# EAGLE design SAMD51_Thing_Plus (EAGLE 7.6.0)
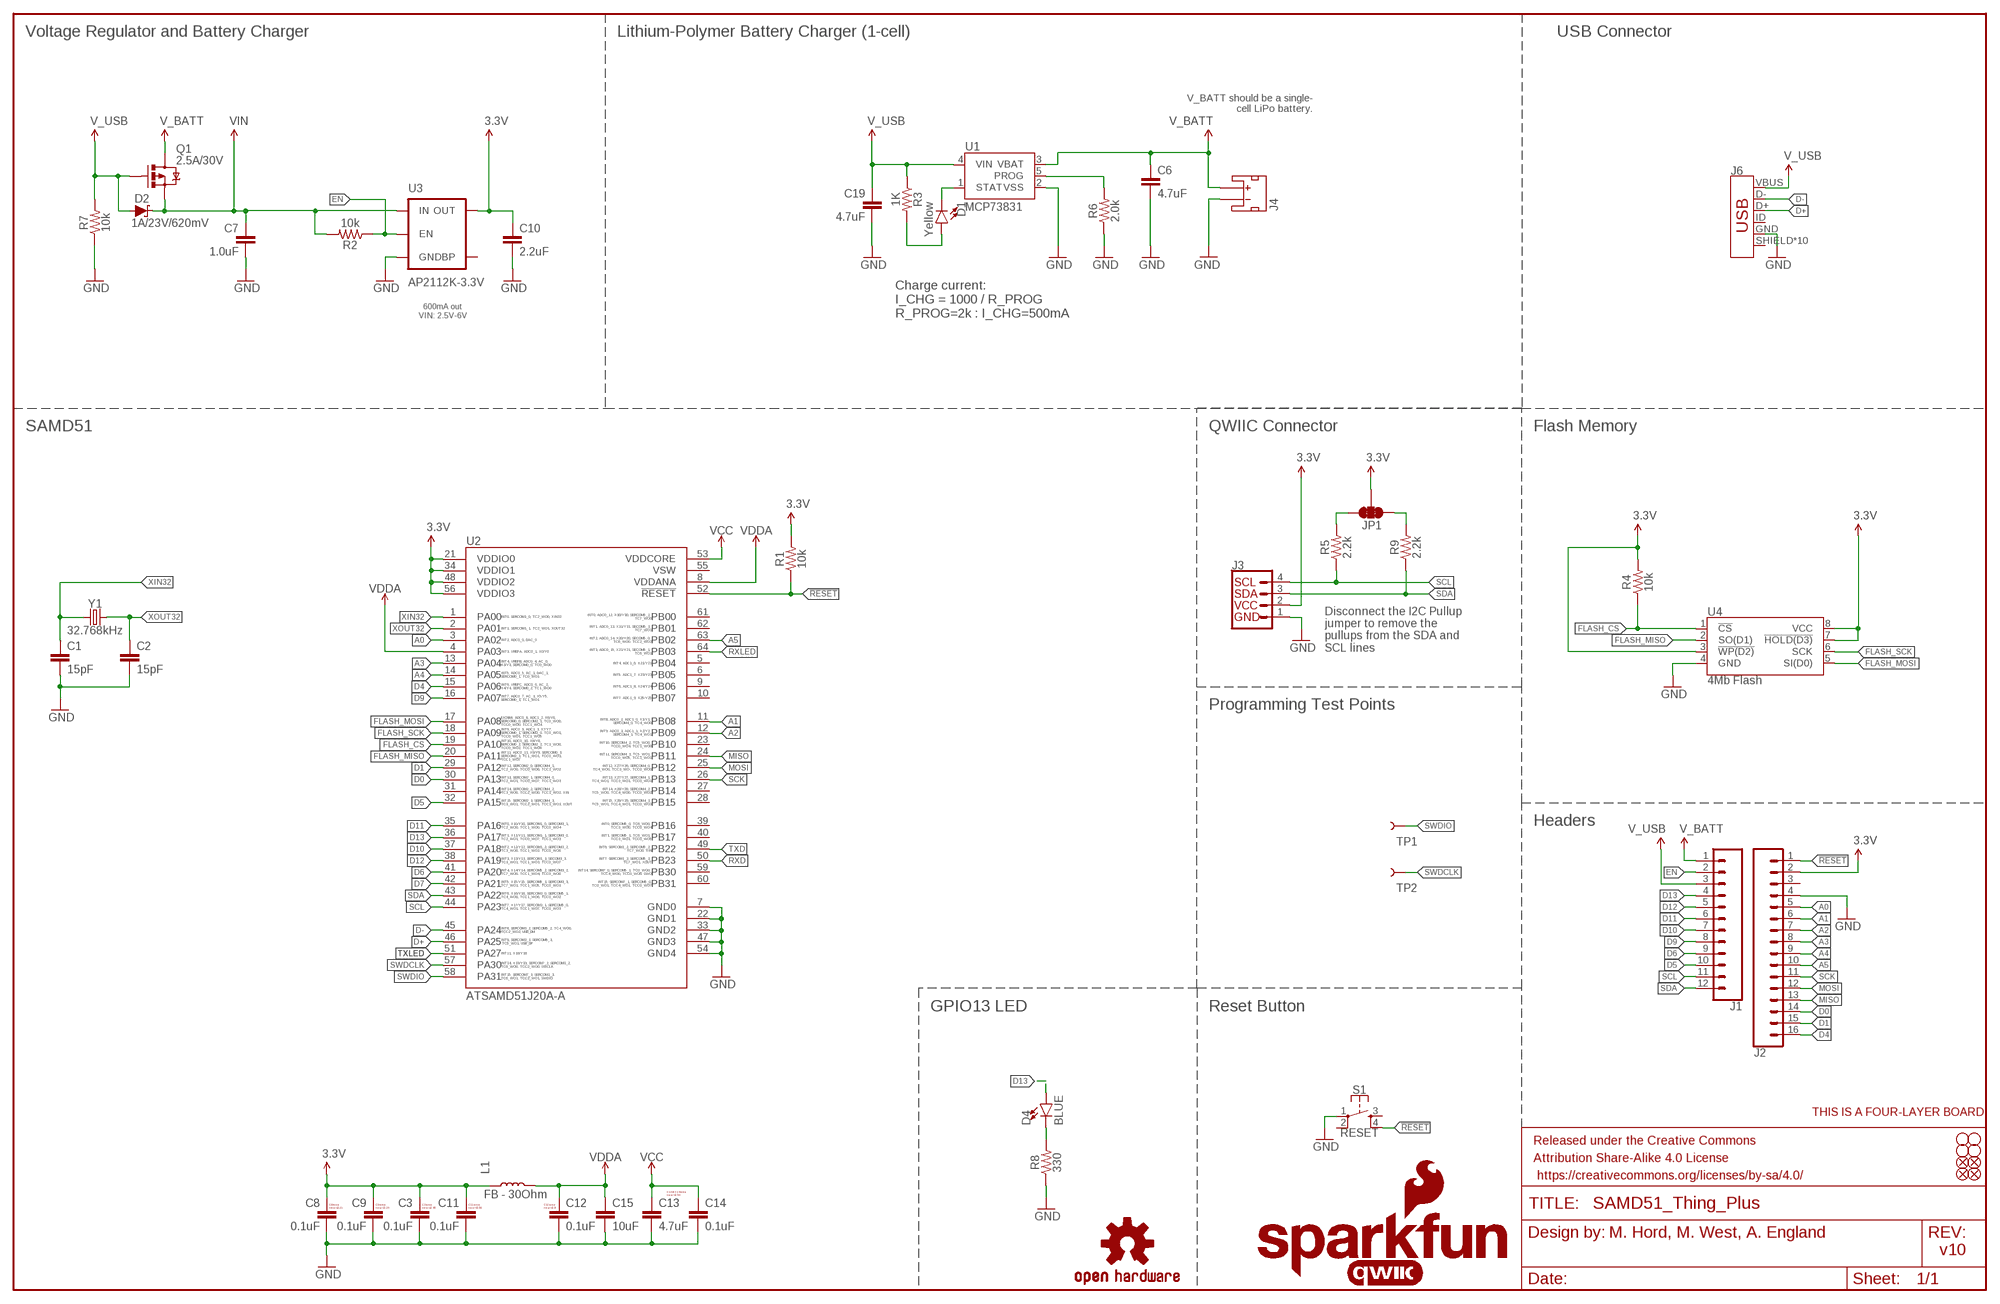
[diagram p0: schematic, sheet 1]

## Parts
C1  15pF  15PF-0402-50V-5%  [0402]
C2  15pF  15PF-0402-50V-5%  [0402]
C3  0.1uF  0.1UF-0402-16V-10%  [0402]
C6  4.7uF  4.7UF-0603-6.3V-(10%)  [0603]
C7  1.0uF  1.0UF-0603-16V-10%-X7R  [0603]
C8  0.1uF  0.1UF-0402-16V-10%  [0402]
C9  0.1uF  0.1UF-0402-16V-10%  [0402]
C10  2.2uF  2.2UF-0603-10V-20%  [0603]
C11  0.1uF  0.1UF-0402-16V-10%  [0402]
C12  0.1uF  0.1UF-0402-16V-10%  [0402]
C13  4.7uF  4.7UF-0603-6.3V-(10%)  [0603]
C14  0.1uF  0.1UF-0402-16V-10%  [0402]
C15  10uF  10UF-0805-10V-10%  [0805]
C19  4.7uF  4.7UF-0603-6.3V-(10%)  [0603]
D1  Yellow  LED-YELLOW0603  [LED-0603]
D2  1A/23V/620mV  DIODE-SCHOTTKY-BAT20J  [SOD-323]
D4  BLUE  LED-BLUE0603  [LED-0603]
FD1  FIDUCIALUFIDUCIAL  [FIDUCIAL-MICRO]
FD2  FIDUCIALUFIDUCIAL  [FIDUCIAL-MICRO]
FD3  FIDUCIALUFIDUCIAL  [FIDUCIAL-MICRO]
FD4  FIDUCIALUFIDUCIAL  [FIDUCIAL-MICRO]
FRAME1  FRAME-LEDGER  [CREATIVE_COMMONS]
H1  STAND-OFF  [STAND-OFF]
H2  STAND-OFF  [STAND-OFF]
H3  STAND-OFF  [STAND-OFF]
H4  STAND-OFF  [STAND-OFF]
J1  CONN_12SM_SQ_NO_SILK  [1X12_SM_SQ_NOSILK]
J2  CONN_161X16_SM_SQ_NOSILK  [1X16_SM_SQ_NOSILK]
J3  QWIIC_CONNECTORJS-1MM  [JST04_1MM_RA]
J4  JST_2MM_MALE  [JST-2-SMD]
J6  AMP FCI 10103594-0001LF  USB_MICRO-B_HALF_PTH_MILL  [USB-MICROB-PTH-MILL]
JP1  JUMPER-SMT_3_2-NC_TRACE_SILK  [SMT-JUMPER_3_2-NC_TRACE_SILK]
L1  FB - 30Ohm  INDUCTORFB-30OHM  [0603]
LOGO1  FOUR_LAYER_WARNING  [FOUR_LAYER_WARNING]
LOGO2  OSHW-LOGOMINI  [OSHW-LOGO-MINI]
LOGO3  SFE_LOGO_NAME_FLAME.1_INCH  [SFE_LOGO_NAME_FLAME_.1]
LOGO4  SFE_LOGO_FLAME.1_INCH  [SFE_LOGO_FLAME_.1]
Q1  2.5A/30V  MOSFET-PCHANNELDMG2307L  [SOT23-3@1]
R1  10k  10KOHM-0603-1/10W-1%  [0603]
R2  10k  10KOHM-0603-1/10W-1%  [0603]
R3  1K  1KOHM-1/10W-1%(0603)  [0603]
R4  10k  10KOHM-0603-1/10W-1%  [0603]
R5  2.2k  2.2KOHM-0603-1/10W-1%  [0603]
R6  2.0k  2.0KOHM1/10W5%(0603)  [0603]
R7  10k  10KOHM-0603-1/10W-1%  [0603]
R8  330  330OHM1/10W1%(0603)  [0603]
R9  2.2k  2.2KOHM-0603-1/10W-1%  [0603]
S1  RESET  MOMENTARY-SWITCH-SPST-2-SMD-4.6X2.8MM  [TACTILE_SWITCH_SMD_4.6X2.8MM]
TP1  TEST-POINTTP_15TH_THRU  [TP_15TH]
TP2  TEST-POINTTP_15TH_THRU  [TP_15TH]
U1  MCP73831  [SOT23-5]
U2  ATSAMD51J20A-A  [TQFP64]
U3  AP2112K-3.3V  V_REG_LDOSMD  [SOT23-5]
U4  4Mb Flash  AT25SF041  [SO08]
U$69  QWIIC_LOGO_5MM  [QWIIC_5MM]
Y1  32.768kHz  CRYSTAL-32.768KHZSMD-3.2X1.5  [CRYSTAL-SMD-3.2X1.5MM]

## Nets
3.3V: C3.1 C8.1 C9.1 C10.1 C11.1 J2.2 J3.2 JP1.2 L1.1 R1.2 R4.2 U2.21(VDDIO0) U2.34(VDDIO1) U2.48(VDDIO2) U2.56(VDDIO3) U3.5(OUT) U4.3(!WP(D2)) U4.7(!HOLD(D3)) U4.8(VCC)
!RESET: J2.1 R1.1 S1.4 U2.52(!RESET)
A0: J2.5 U2.3(PA02)
A1: J2.6 U2.11(PB08)
A2: J2.7 U2.12(PB09)
A3: J2.8 U2.13(PA04)
A4: J2.9 U2.14(PA05)
A5: J2.10 U2.63(PB02)
D0: J2.14 U2.30(PA13)
D1: J2.15 U2.29(PA12)
D4: J2.16 U2.15(PA06)
D5: J1.10 U2.32(PA15)
D6: J1.9 U2.41(PA20)
D7: U2.42(PA21)
D9: J1.8 U2.16(PA07)
D10: J1.7 U2.37(PA18)
D11: J1.6 U2.35(PA16)
D12: J1.5 U2.38(PA19)
D13: D4.A J1.4 U2.36(PA17)
D+: J6.D+ U2.46(PA25)
D-: J6.D- U2.45(PA24)
EN: J1.2 R2.1 U3.3(EN)
FLASH_CS: R4.1 U2.19(PA10) U4.1(!CS)
FLASH_MISO: U2.20(PA11) U4.2(SO(D1))
FLASH_MOSI: U2.17(PA08) U4.5(SI(D0))
FLASH_SCK: U2.18(PA09) U4.6(SCK)
GND: C1.2 C2.2 C3.2 C6.2 C7.2 C8.2 C9.2 C10.2 C11.2 C12.2 C13.2 C14.2 C15.2 C19.2 J2.4 J3.1 J4.1(-) J6.GND R6.1 R7.1 R8.1 S1.1 U1.2(VSS) U2.7(GND0) U2.22(GND1) U2.33(GND2) U2.47(GND3) U2.54(GND4) U3.2(GND) U4.4(GND)
MISO: J2.13 U2.24(PB11)
MOSI: J2.12 U2.25(PB12)
N$1: D4.C R8.2
N$2: JP1.3 R5.2
N$3: JP1.1 R9.2
N$9: D1.C U1.1(STAT)
N$14: R6.2 U1.5(PROG)
N$17: D1.A R3.2
RXD: U2.50(PB23)
RXLED: U2.64(PB03)
SCK: J2.11 U2.26(PB13)
SCL: J1.11 J3.4 R5.1 U2.44(PA23)
SDA: J1.12 J3.3 R9.1 U2.43(PA22)
SWDCLK: TP2.P$1 U2.57(PA30)
SWDIO: TP1.P$1 U2.58(PA31)
TXD: U2.49(PB22)
TXLED: U2.51(PA27)
V_BATT: C6.1 J1.1 J4.2(+) Q1.3(D) U1.3(VBAT)
V_USB: C19.1 D2.A J1.3 J6.VBUS Q1.1(G) R3.1 R7.2 U1.4(VIN)
VCC: C13.1 C14.1 U2.53(VDDCORE)
VDDA: C12.1 C15.1 L1.2 U2.4(PA03) U2.8(VDDANA)
VIN: C7.1 D2.C Q1.2(S) R2.2 U3.1(IN)
XIN32: C1.1 U2.1(PA00) Y1.P$1
XOUT32: C2.1 U2.2(PA01) Y1.P$2
Unconnected: J2.3 J4.NC1(PAD1) J4.NC2(PAD2) J6.ID J6.SHIELD J6.SHIELD2(SHIELD) J6.SHIELD3(SHIELD) J6.SHIELD4(SHIELD) J6.SHIELD5(SHIELD) J6.SHIELD6(SHIELD) J6.SHIELD7(SHIELD) J6.SHIELD8(SHIELD) J6.SHIELD9(SHIELD) J6.SHIELD10(SHIELD) S1.2 S1.3 U2.5(PB04) U2.6(PB05) U2.9(PB06) U2.10(PB07) U2.23(PB10) U2.27(PB14) U2.28(PB15) U2.31(PA14) U2.39(PB16) U2.40(PB17) U2.55(VSW) U2.59(PB30) U2.60(PB31) U2.61(PB00) U2.62(PB01) U3.4(BP)

## Notes on the sheet
- Voltage Regulator and Battery Charger | Lithium-Polymer Battery Charger (1-cell)
- USB Connector
- V_BATT should be a single-
  cell LiPo battery.
- Charge current:
  I_CHG = 1000 / R_PROG
  R_PROG=2k : I_CHG=500mA
- 600mA out
  VIN: 2.5V-6V
- SAMD51 | QWIIC Connector | Flash Memory
- Disconnect the I2C Pullup 
  jumper to remove the 
  pullups from the SDA and 
  SCL lines
- Programming Test Points
- Headers
- GPIO13 LED | Reset Button
- C13 & C14 to be
  near U2.53
- C8 to be
  near U2.21
- C9 to be
  near U2.34
- C3 to be
  near U2.48
- C11 to be
  near U2.56
- C12 to be
  near U2.8
- M. Hord, M. West, A. England
- v10

## Library data of the parts
C1 C2 = SparkFun-Capacitors:15PF: 15pF ceramic capacitors A capacitor is a passive two-terminal electrical component used to store electrical energy temporarily in an electric field.; PROD_ID: CAP-13063
C3 C8 C9 C11 C12 C14 = SparkFun-Capacitors:0.1UF: 0.1µF ceramic capacitors A capacitor is a passive two-terminal electrical component used to store electrical energy temporarily in an electric field.; PROD_ID: CAP-12416
C6 C13 C19 = SparkFun-Capacitors:4.7UF: 4.7µF ceramic capacitors A capacitor is a passive two-terminal electrical component used to store electrical energy temporarily in an electric field.; PROD_ID: CAP-08280
C7 = SparkFun-Capacitors:1.0UF: 1µF ceramic capacitors A capacitor is a passive two-terminal electrical component used to store electrical energy temporarily in an electric field.; PROD_ID: CAP-13930
C10 = SparkFun-Capacitors:2.2UF: 2.2µF ceramic capacitors A capacitor is a passive two-terminal electrical component used to store electrical energy temporarily in an electric field.; PROD_ID: CAP-07888
C15 = SparkFun-Capacitors:10UF: 10.0µF ceramic capacitors A capacitor is a passive two-terminal electrical component used to store electrical energy temporarily in an electric field.; PROD_ID: CAP-11330
D1 = SparkFun-LED:LED-YELLOW: Yellow SMD LED Used in manufacturing several products at SparkFun. Packages: 0603 - SMD 0603 package[Product Link] <http://www.kingbrightusa.com/product.asp?catalog_name=LED&product_id=APT1608SYCK> 0603 -SMART - SMART SMD 0603 package (more efficient/more expensive) [Product Link] <http://www.osram-os.com/osram_os/en/products/product-catalog/led-light-emitting-diodes/smartled-0603/ly-l29k/index.jsp> LilyPad - SMD1206 package[Product Datasheet] <https://www.sparkfun.com/datasheets/DevTools/LilyPad/Q150YUS4.pdf> SparkFun Products: Blynk Board <https://www.sparkfun.com/products/13794> IOIO-OTG <https://www.sparkfun.com/products/13613> XBee Explorer Serial <https://www.sparkfun.com/products/13225>; PROD_ID: DIO-09003
D2 = SparkFun-DiscreteSemi:DIODE-SCHOTTKY: Schottky diode A Schottky diode is a semiconductor diode which has a low forward voltage drop and a very fast switching action.; PROD_ID: DIO-11623
D4 = SparkFun-LED:LED-BLUE: Blue SMD LED Used in manufacturing of various products at SparkFun Packages: 0603 - SMD 0603 package [Product Link] <http://www.digikey.com/product-detail/en/SMLE12BC7TT86/511-1589-2-ND/1641808> 1206 - SMD1206 package [Product Link] <http://www.digikey.com/product-detail/en/lite-on-inc/LTST-C150TBKT/160-1643-1-ND/573584> SparkFun Products: ESP8266 Thing-Dev Board <https://www.sparkfun.com/products/13711> RedBoard <https://www.sparkfun.com/products/12757>; PROD_ID: DIO-08575
FD1-FD4 = SparkFun-Aesthetics:FIDUCIAL: Fiducial Alignment Points Point-of-reference for pick-and-place machines and other optical instruments.
FRAME1 = SparkFun-Aesthetics:FRAME-LEDGER: Schematic Frame - Ledger Standard 11x14 US Ledger frame
H1-H4 = SparkFun-Hardware:STAND-OFF: Stand Off Drill holes for mechanically mounting via screws, standoffs, etc. Note: Use the keepout ring to avoid running the screw head into surrounding components. Variant Overviews STAND-OFF - Mechanical footprint for a #4 phillips button head screw. STAND-OFF-TIGHT - Mechanical footprint for a #4 phillips button head screw, Example SparkFun Products Screw - Phillips Head (1/4", 4-40, 10 pack) <https://www.sparkfun.com/products/10453> (PRT-10453) Screw - Phillips Head (1/2", 4-40, 10 pack) <https://www.sparkfun.com/products/10452> (PRT-10452) Screw - Phillips Head (3/4", 4-40, 10 pack) <https://www.sparkfun.com/products/10451> (PRT-10451) Screw - Phillips Head (1", 4-40, 10 pack) <https://www.sparkfun.com/products/10450> (PRT-10450)
J1 = SparkFun-Connectors:CONN_12: Multi connection point. Often used as Generic Header-pin footprint for 0.1 inch spaced/style header connections On any of the 0.1 inch spaced packages, you can populate with these: Break Away Headers - Straight <https://www.sparkfun.com/products/116> (PRT-00116) Break Away Male Headers - Right Angle <https://www.sparkfun.com/products/553> (PRT-00553) Female Headers <https://www.sparkfun.com/products/115> (PRT-00115) Break Away Headers - Machine Pin <https://www.sparkfun.com/products/117> (PRT-00117) Break Away Female Headers - Swiss Machine Pin <https://www.sparkfun.com/products/743> (PRT-00743) For SCREWTERMINALS and SPRING TERMINALS visit here: Screw Terimnals on SparkFun.com <https://www.sparkfun.com/search/results?term=Screw+Terminals> (5mm/3.5mm/2.54mm spacing) This device is also useful as a general connection point to wire up your design to another part of your project. Our various solder wires solder well into these plated through hole pads. Hook-Up Wire - Assortment (Stranded, 22 AWG) <https://www.sparkfun.com/products/11375> (PRT-11375) Hook-Up Wire - Assortment (Solid Core, 22 AWG) <https://www.sparkfun.com/products/11367> (PRT-11367) View the entire wire category on our website here <https://www.sparkfun.com/categories/141> Special notes: Molex polarized connector foot print use with SKU : PRT-08231 with associated crimp pins and housings. 1MM SMD Version SKU: PRT-10208 NOTES ON THE VARIANTS LOCK and LOCK_LONGPADS... This footprint was designed to help hold the alignment of a through-hole component (i.e. 6-pin header) while soldering it into place. You may notice that each hole has been shifted either up or down by 0.005 of an inch from it's more standard position (which is a perfectly straight line). This slight alteration caused the pins (the squares in the middle) to touch the edges of the holes. Because they are alternating, it causes a "brace" to hold the component in place. 0.005 has proven to be the perfect amount of "off-center" position when using our standard breakaway headers. Although looks a little odd when you look at the bare footprint, once you have a header in there, the alteration is very hard to notice. Also,if you push a header all the way into place, it is covered up entirely on the bottom side.
J2 = SparkFun-Connectors:CONN_16: Multi connection point. Often used as Generic Header-pin footprint for 0.1 inch spaced/style header connections On any of the 0.1 inch spaced packages, you can populate with these: Break Away Headers - Straight <https://www.sparkfun.com/products/116> (PRT-00116) Break Away Male Headers - Right Angle <https://www.sparkfun.com/products/553> (PRT-00553) Female Headers <https://www.sparkfun.com/products/115> (PRT-00115) Break Away Headers - Machine Pin <https://www.sparkfun.com/products/117> (PRT-00117) Break Away Female Headers - Swiss Machine Pin <https://www.sparkfun.com/products/743> (PRT-00743) For SCREWTERMINALS and SPRING TERMINALS visit here: Screw Terimnals on SparkFun.com <https://www.sparkfun.com/search/results?term=Screw+Terminals> (5mm/3.5mm/2.54mm spacing) This device is also useful as a general connection point to wire up your design to another part of your project. Our various solder wires solder well into these plated through hole pads. Hook-Up Wire - Assortment (Stranded, 22 AWG) <https://www.sparkfun.com/products/11375> (PRT-11375) Hook-Up Wire - Assortment (Solid Core, 22 AWG) <https://www.sparkfun.com/products/11367> (PRT-11367) View the entire wire category on our website here <https://www.sparkfun.com/categories/141> Special notes: Molex polarized connector foot print use with SKU : PRT-08231 with associated crimp pins and housings. 1MM SMD Version SKU: PRT-10208 NOTES ON THE VARIANTS LOCK and LOCK_LONGPADS... This footprint was designed to help hold the alignment of a through-hole component (i.e. 6-pin header) while soldering it into place. You may notice that each hole has been shifted either up or down by 0.005 of an inch from it's more standard position (which is a perfectly straight line). This slight alteration caused the pins (the squares in the middle) to touch the edges of the holes. Because they are alternating, it causes a "brace" to hold the component in place. 0.005 has proven to be the perfect amount of "off-center" position when using our standard breakaway headers. Although looks a little odd when you look at the bare footprint, once you have a header in there, the alteration is very hard to notice. Also,if you push a header all the way into place, it is covered up entirely on the bottom side.
J3 = SparkFun-Connectors:QWIIC_CONNECTOR: SparkFun I2C Standard Qwiic Connector An SMD 1mm pitch JST connector makes it easy and quick (get it? Qwiic?) to connect I2C devices to each other. The Qwiic system <http://www.sparkfun.com/qwiic> enables fast and solderless connection between popular platforms and various sensors and actuators. We carry 200mm <https://www.sparkfun.com/products/14204>, 100mm <https://www.sparkfun.com/products/14205>, 50mm <https://www.sparkfun.com/products/14206>, and breadboard friendly <https://www.sparkfun.com/products/14207> Qwiic cables. We also offer 10 pcs strips <https://www.sparkfun.com/products/14323> the SMD connectors.; PROD_ID: CONN-13694
J4 = SparkFun-Connectors:JST_2MM_MALE: JST 2MM MALE RA CONNECTOR Two pin, compact surface mount connector. Commonly used as a battery input connection point. We really like the solid locking feeling and high current rating on these small connectors. We use these all the time as battery connectors. Mates to single-cell LiPo batteries. Here is the connector we sell at SparkFun: JST Right Angle Connector - White <https://www.sparkfun.com/products/8612> (PRT-08612) Datasheet <http://www.sparkfun.com/datasheets/Prototyping/Connectors/JST-Horizontal.pdf> It was used on these SparkFun products: SparkFun MOSFET Power Controller <https://www.sparkfun.com/products/11214> (PRT-11214) SparkFun Battery Babysitter - LiPo Battery Manager <https://www.sparkfun.com/products/13777> (PRT-13777) And many, many others that required a lipo battery connection.; PROD_ID: CONN-11443; SF_ID: PRT-08612
J6 = SparkFun-Connectors:USB_MICRO-B: USB Type Micro-B Connector Male/female and PTH/SMT variants SparkFun Products: SparkFun microB USB Breakout <https://www.sparkfun.com/products/12035> SparkFun USB microB Plug Breakout <https://www.sparkfun.com/products/10031> SparkFun ESP8266 Thing <https://www.sparkfun.com/products/13231>; PROD_ID: CONN-13711
JP1 = SparkFun-Jumpers:JUMPER-SMT_3_2-NC_TRACE: Normally closed trace jumper (2 of 2 connections) This jumper has a trace between all three pads so they are normally closed (NC). Use a razor knife to open the connection(s). For best results follow the IPC guidelines for cutting traces: Cutout at least 0.063 mm (0.005 in). Remove all loose material to clean up the cut area. Seal the cut with an approved epoxy. Reapply solder to reclose the connection(s).
L1 = SparkFun-Coils:INDUCTOR: Inductors Resist changes in electrical current. Basically a coil of wire. SparkFun Products: SparkFun Load Cell Amplifier - HX711 <https://www.sparkfun.com/products/13879> IOIO-OTG - V2.2 <https://www.sparkfun.com/products/13613>; PROD_ID: NDUC-07859
LOGO1 = SparkFun-Aesthetics:FOUR_LAYER_WARNING: Four-Layer Board Warning - tDoc Layer Warning text which will appear on both the schematic and the board file, notifying viewers that the design is a four-layer PCB.
LOGO2 = SparkFun-Aesthetics:OSHW-LOGO: Open-Source Hardware (OSHW) Logo This logo indicates the piece of hardware it is found on incorporates a OSHW license and/or adheres to the definition of open source hardware found here: http://freedomdefined.org/OSHW
LOGO3 = SparkFun-Aesthetics:SFE_LOGO_NAME_FLAME: SparkFun Font Logo w/ Flame This is the SparkFun full logo. The logo on the schematic will always be the same size; the package variant is the height of the flame part of the logo. Default layer for the logo on the board is tSilk.
LOGO4 = SparkFun-Aesthetics:SFE_LOGO_FLAME: SparkFun Flame Logo This is the SparkFun flame logo. The logo on the schematic will always be the same size; the package variant is the height of the flame. Default layer for the logo on the board is tSilk.
Q1 = SparkFun-DiscreteSemi:MOSFET-PCHANNEL: Generic PMOSFET IRLML2244 - TRANS-11153 (SOT-23 -20V -4.3A) (1.Gate 2.Source 3.Drain) FQP27P06 - COM-10349 <http://www.sparkfun.com/products/10349> (TO-220 -60V -27A) (1.Gate 2.Source 3.Drain); PROD_ID: TRANS-11308
R1 R2 R4 R7 = SparkFun-Resistors:10KOHM: 10kΩ resistor A resistor is a passive two-terminal electrical component that implements electrical resistance as a circuit element. Resistors act to reduce current flow, and, at the same time, act to lower voltage levels within circuits. - Wikipedia; PROD_ID: RES-00824
R3 = SparkFun-Resistors:1KOHM-1/10W-1%(0603): RES-07856; PROD_ID: RES-07856
R5 R9 = SparkFun-Resistors:2.2KOHM: 2.2kΩ resistor A resistor is a passive two-terminal electrical component that implements electrical resistance as a circuit element. Resistors act to reduce current flow, and, at the same time, act to lower voltage levels within circuits. - Wikipedia; PROD_ID: RES-08272
R6 = SparkFun-Resistors:2.0KOHM1/10W5%(0603): RES-08296; PROD_ID: RES-08296
R8 = SparkFun-Resistors:330OHM1/10W1%(0603): RES-00818; PROD_ID: RES-00818
S1 = SparkFun-Switches:MOMENTARY-SWITCH-SPST-2: Momentary Switch (Pushbutton) - SPST - Two Circuits Normally-open (NO) SPST momentary switches (buttons, pushbuttons). Schematic symbol includes two switch circuits. Variants SMD-4.6MMX2.8MM - 4.60mm x 2.80mm Tactile Momentary Button Switch - Used on SparkFun SAMD21 Mini Breakout <https://www.sparkfun.com/products/13664> SMD-5.2MM - Mini Pushbutton Switch - SMD <https://www.sparkfun.com/products/8720> - Used on Arduino Pro Mini <https://www.sparkfun.com/products/11114>; PROD_ID: SWCH-13065
TP1 TP2 = SparkFun-Connectors:TEST-POINT: SparkFun Test Points Bare copper test points for troubleshooting or In-Circuit-Testing. These are used by our Production team for verifying production board runs using pogo-pins on test beds. SparkFun Products: SparkFun LSM9DS1 Breakout <https://www.sparkfun.com/products/13284> SparkFun PSOC <https://www.sparkfun.com/products/13714> SparkFun Load Cell Amplifier <https://www.sparkfun.com/products/13879>
U1 = SparkFun-PowerIC:MCP73831: Miniature single cell, fully integrated Li-Ion, Li-polymer charge management controller http://ww1.microchip.com/downloads/en/DeviceDoc/20001984g.pdf IC-09995; PROD_ID: IC-09995
U2 = SparkFun-IC-Microcontroller:ATSAMD51J20A-A; PROD_ID: IC-13952
U3 = SparkFun-PowerIC:V_REG_LDO: Voltage Regulator LDO Standard 150mA LDO voltage regulator in SOT-23 layout. Micrel part MIC5205. BP (by-pass) pin is used to lower output noise with 470pF cap.; PROD_ID: VREG-12457
U4 = SparkFun-IC-Memory:AT25SF041: AT25SF041 4Mb Serial Flash Memory 104MHz, SPI, 8-SOIC Datasheet <http://www.adestotech.com/wp-content/uploads/DS-AT25SF041_044.pdf> SparkFun Products: SparkFun ESP8266 Thing <https://www.sparkfun.com/products/13231> SparkFun ESP8266 Thing - Dev Board <https://www.sparkfun.com/products/13711>; PROD_ID: IC-12455; VALUE: 4MB Flash
U$69 = SparkFun-Aesthetics:QWIIC_LOGO: Qwiic Logos for placement on schematic and PCB. The 5.5mm silk logo is best for placing next to Qwiic connector.
Y1 = SparkFun-Clocks:CRYSTAL-32.768KHZ: 32.768kHz Crystal Frequency: 32.768kHz Frequency Stability: ±20ppm Load Capacitance: 12.5pF (PTH-2X6 & SMD-3.2X1.5), 6pF (SMD-2X6) SparkFun Products: SparkFun BigTime Watch Kit <https://www.sparkfun.com/products/11734> SparkFun nRF52832 Breakout <https://www.sparkfun.com/products/13990> SparkFun Real Time Clock Module <https://www.sparkfun.com/products/12708>; PROD_ID: XTAL-13062

## Board
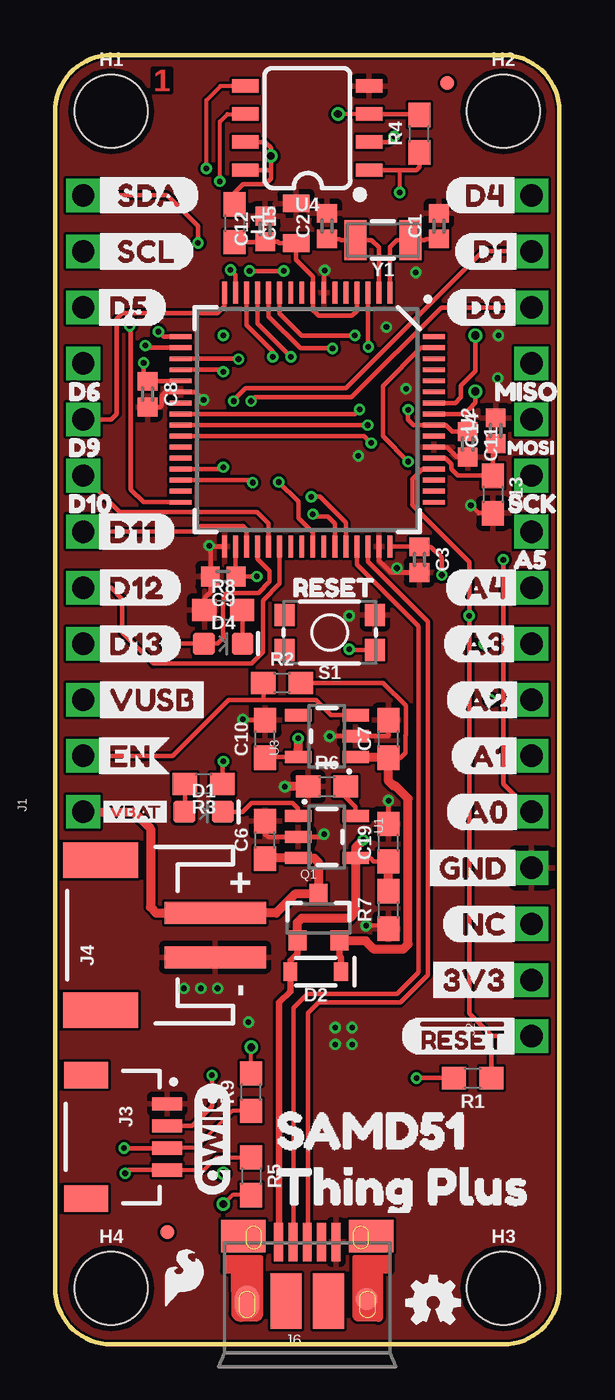
[diagram p1: board, top side]
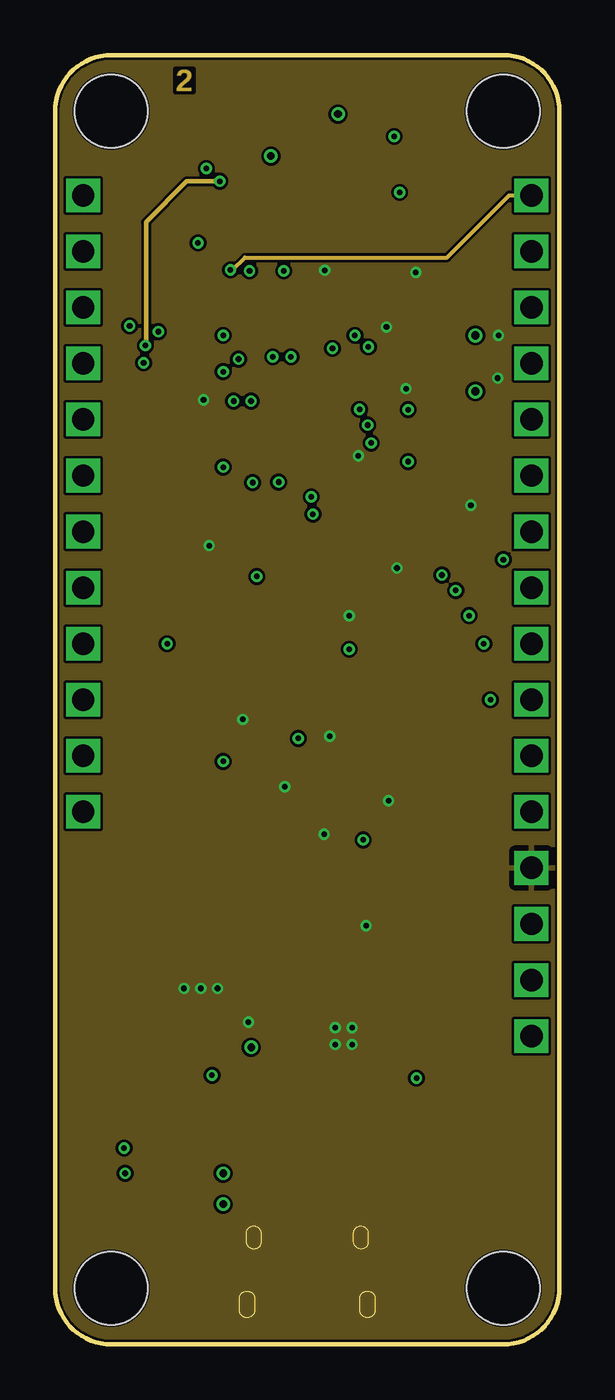
[diagram p2: board, inner layer Route2]
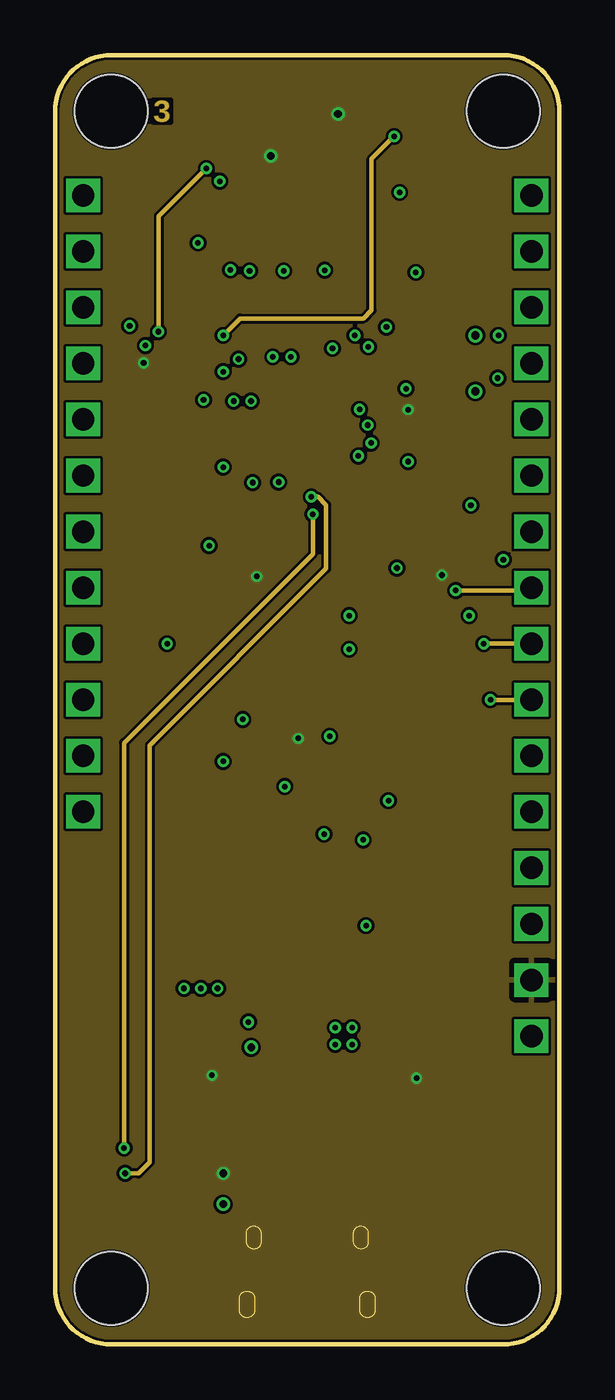
[diagram p3: board, inner layer Route15]
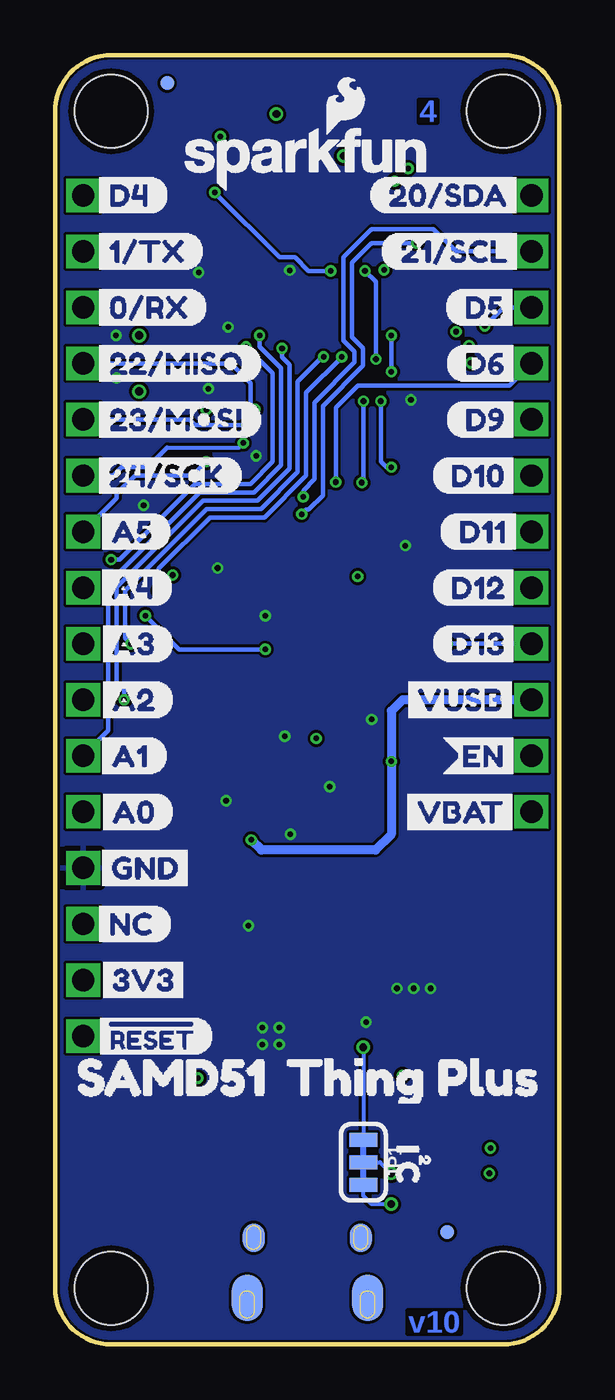
[diagram p4: board, bottom side, seen from below]

Size 22.86 x 58.42 mm. Coordinates in mm from the lower left corner, seen from the top.
Outline: 2.54,58.42 20.32,58.42 arc-90 22.86,55.88 22.86,2.54 arc-90 20.32,0 2.54,0 arc-90 0,2.54 0,55.88 arc-90 2.54,58.42
Copper layers (1*2*15*16): Top 0.035559375mm / dielectric 0.47751875mm / Route2 0.035559375mm / dielectric 0.47751875mm / Route15 0.035559375mm / dielectric 0.47751875mm / Bottom 0.035559375mm
Design rules "SparkFun-4-layer-FAB-LIMIT": minimum track width 4mil, minimum drill 6mil, track to track 5mil, track to pad 5mil, pad to pad 5mil, via to via 5mil, smd to smd 5mil, copper to edge 4mil, drill to drill 4mil, minimum pad ring 5mil, minimum via ring 5mil, stop-mask expansion 4mil, vias tented up to drill 25mil, thermal gap 10mil

### Footprints (pad centres in the part's own frame; a part is rotated, then mirrored left to right if it is on the bottom)
0402 = smd 0.85 x 0.9: 1 -0.58,0; 2 0.58,0
0603 = smd 1.1 x 1: 1 -0.85,0; 2 0.85,0
0805 = smd 0.8 x 1.2: 1 -0.9,0; 2 0.9,0
LED-0603 = smd 1 x 1: A -0.877,0; C 0.877,0
SOD-323 = smd 0.63 x 0.83: A 1.15,0; C -1.15,0
FIDUCIAL-MICRO = smd 0.635 x 0.635: 1 0,0
STAND-OFF = hole 3.302: 0,0
1X12_SM_SQ_NOSILK = drill 1.016 pad 1.27 square: 1 0,0; 2 2.54,0; 3 5.08,0; 4 7.62,0; 5 10.16,0; 6 12.7,0; 7 15.24,0; 8 17.78,0; 9 20.32,0; 10 22.86,0; 11 25.4,0; 12 27.94,0
1X16_SM_SQ_NOSILK = drill 1.016 pad 1.27 square: 1 0,0; 2 2.54,0; 3 5.08,0; 4 7.62,0; 5 10.16,0; 6 12.7,0; 7 15.24,0; 8 17.78,0; 9 20.32,0; 10 22.86,0; 11 25.4,0; 12 27.94,0; 13 30.48,0; 14 33.02,0; 15 35.56,0; 16 38.1,0
JST04_1MM_RA = smd 0.6 x 1.35: 1 -1.5,0; 2 -0.5,0; 3 0.5,0; 4 1.5,0 | smd 1.2 x 2: NC1 2.8,-3.675; NC2 -2.8,-3.675
JST-2-SMD = smd 1 x 4.6: 1 -1,-3.7; 2 1,-3.7 | smd 1.6 x 3.4: NC1 -3.4,1.5; NC2 3.4,1.5
USB-MICROB-PTH-MILL = smd 0.4 x 1.75: D+ 0,0; D- -0.65,0; GND 1.3,0; ID 0.65,0; VBUS -1.3,0 | smd 2 x 1.46: SHIELD -2.9,0.275; SHIELD2 2.9,0.275 | smd 1.425 x 2.5: SHIELD3 -0.963,-2.675; SHIELD4 0.963,-2.675 | smd 1.4 x 2.1 bottom: SHIELD5 -2.731,-2.531; SHIELD7 2.729,-2.531 | smd 1 x 1: SHIELD6 2.7,-2.575 | smd 1.1 x 1.5: SHIELD8 -2.731,-2.731 | smd 1 x 1.3 bottom: SHIELD9 -2.43,0.195; SHIELD10 2.43,0.195
SMT-JUMPER_3_2-NC_TRACE_SILK = smd 0.635 x 1.27: 1 -1.016,0; 2 0,0; 3 1.016,0
SOT23-3@1 = smd 0.8 x 0.9: 1 -0.95,-1; 2 0.95,-1; 3 0,1.1
TACTILE_SWITCH_SMD_4.6X2.8MM = smd 0.9 x 1: 1 -2.05,-0.8; 2 2.05,-0.8; 3 2.05,0.8; 4 -2.05,0.8
TP_15TH = drill 0.381 pad 0.61: P$1 0,0
SOT23-5 = smd 0.55 x 1.2: 1 -0.95,-1.3; 2 0,-1.3; 3 0.95,-1.3; 4 0.95,1.3; 5 -0.95,1.3
TQFP64 = smd 0.22 x 1: 1 -3.75,-5.75; 2 -3.25,-5.75; 3 -2.75,-5.75; 4 -2.25,-5.75; 5 -1.75,-5.75; 6 -1.25,-5.75; 7 -0.75,-5.75; 8 -0.25,-5.75; 9 0.25,-5.75; 10 0.75,-5.75; 11 1.25,-5.75; 12 1.75,-5.75; 13 2.25,-5.75; 14 2.75,-5.75; 15 3.25,-5.75; 16 3.75,-5.75; 33 3.75,5.75; 34 3.25,5.75; 35 2.75,5.75; 36 2.25,5.75; 37 1.75,5.75; 38 1.25,5.75; 39 0.75,5.75; 40 0.25,5.75; 41 -0.25,5.75; 42 -0.75,5.75; 43 -1.25,5.75; 44 -1.75,5.75; 45 -2.25,5.75; 46 -2.75,5.75; 47 -3.25,5.75; 48 -3.75,5.75 | smd 1 x 0.22: 17 5.75,-3.75; 18 5.75,-3.25; 19 5.75,-2.75; 20 5.75,-2.25; 21 5.75,-1.75; 22 5.75,-1.25; 23 5.75,-0.75; 24 5.75,-0.25; 25 5.75,0.25; 26 5.75,0.75; 27 5.75,1.25; 28 5.75,1.75; 29 5.75,2.25; 30 5.75,2.75; 31 5.75,3.25; 32 5.75,3.75; 49 -5.75,3.75; 50 -5.75,3.25; 51 -5.75,2.75; 52 -5.75,2.25; 53 -5.75,1.75; 54 -5.75,1.25; 55 -5.75,0.75; 56 -5.75,0.25; 57 -5.75,-0.25; 58 -5.75,-0.75; 59 -5.75,-1.25; 60 -5.75,-1.75; 61 -5.75,-2.25; 62 -5.75,-2.75; 63 -5.75,-3.25; 64 -5.75,-3.75
SO08 = smd 0.6 x 1.2: 1 -1.905,-2.8; 2 -0.635,-2.8; 3 0.635,-2.8; 4 1.905,-2.8; 5 1.905,2.8; 6 0.635,2.8; 7 -0.635,2.8; 8 -1.905,2.8
CRYSTAL-SMD-3.2X1.5MM = smd 1 x 1.8: P$1 -1.25,0; P$2 1.25,0

### Placement (x,y rotation side)
C1  17.4,50.67 90 top
C2  12.32,50.67 90 top
C3  16.51,35.56 270 top
C6  9.53,22.86 90 top
C7  15.11,27.43 90 top
C8  4.19,43.05 270 top
C9  7.62,34.8 180 top
C10  9.53,27.43 90 top
C11  18.7,40.79 270 top
C12  9.53,50.55 90 top
C13  19.84,38.51 270 top
C14  19.97,41.4 90 top
C15  10.92,50.8 90 top
C19  15.11,22.73 90 top
D1  6.73,24.13 0 top
D2  11.81,16.89 180 top
D4  7.62,31.75 0 top
FD1  5.08,5.08 0 top
FD2  17.78,57.15 0 top
FD3  5.08,5.08 0 bottom
FD4  17.78,57.15 0 bottom
FRAME1  -17.14,-19.05 0 top  (outside the outline)
H1  2.54,55.88 0 top
H2  20.32,55.88 0 top
H3  20.32,2.54 0 top
H4  2.54,2.54 0 top
J1  1.27,24.13 90 top
J2  21.59,13.97 90 top
J3  5.08,9.4 270 top
J4  3.56,18.54 90 top
J6  11.43,4.64 0 top
JP1  8.89,8.26 270 bottom
L1  8.13,50.8 270 top
LOGO1  35.56,39.37 0 top  (outside the outline)
LOGO2  17.14,1.91 0 top
LOGO3  11.43,53.72 0 bottom
LOGO4  5.84,3.05 0 top
Q1  11.94,19.3 0 top
R1  18.92,12.06 180 top
R2  10.29,29.97 0 top
R3  6.73,25.4 180 top
R4  16.51,54.86 90 top
R5  8.89,7.62 270 top
R6  12.32,25.27 0 top
R7  15.11,19.68 90 top
R8  7.62,33.27 0 top
R9  8.89,11.43 90 top
S1  12.45,32.26 180 top
TP1  19.05,45.72 0 top
TP2  19.05,43.18 0 top
U1  12.32,22.99 270 top
U2  11.43,41.91 180 top
U3  12.32,27.56 90 top
U4  11.43,55.12 90 top
U$4  [RESET27]  10.03,34.29 0 top
U$5  [#RESET15]  21.46,13.97 0 bottom
U$6  [#RESET0]  15.49,13.97 0 top
U$7  [3V32]  16.64,16.51 0 top
U$8  [A04]  17.65,24.13 0 top
U$9  [A15]  17.91,26.67 0 top
U$10  [A26]  17.65,29.21 0 top
U$11  [A37]  17.53,31.75 0 top
U$12  [A48]  17.65,34.29 0 top
U$13  [A523]  20.07,35.56 0 top
U$14  [SCK24]  19.81,38.1 0 top
U$15  [3V33]  21.21,16.51 0 bottom
U$16  [MISO26]  19.18,43.18 0 top
U$17  [D09]  17.65,46.99 0 top
U$18  [D110]  18.03,49.53 0 top
U$19  [D411]  17.65,52.07 0 top
U$20  [GND3]  16.51,21.59 0 top
U$21  [GND0]  21.21,21.59 0 bottom
U$22  [EN0]  1.52,26.67 0 top
U$23  [VUSB2]  1.52,29.21 0 top
U$24  [D1312]  1.52,31.75 0 top
U$25  [D120]  1.52,34.29 0 top
U$26  [D1113]  1.52,36.83 0 top
U$27  [A014]  21.21,24.13 0 bottom
U$28  [A113]  21.21,26.67 0 bottom
U$29  [D515]  1.52,46.99 0 top
U$30  [_SCL16]  1.52,49.53 0 top
U$31  [ORDERING_INSTRUCTIONS]  34.29,50.8 0 top  (outside the outline)
U$32  [_SDA17]  1.52,52.07 0 top
U$33  [D63]  -0.13,43.18 0 top
U$34  [D92]  -0.13,40.64 0 top
U$35  [MOSI0]  19.94,40.64 0 top
U$36  [VBAT1]  1.91,24.13 0 top
U$37  [A212]  21.21,29.21 0 bottom
U$38  [A311]  21.21,31.75 0 bottom
U$39  [A410]  21.21,34.29 0 bottom
U$40  [A59]  21.21,36.83 0 bottom
U$41  [21#SCL1]  8.13,49.53 0 bottom
U$42  [22#MISO4]  21.34,44.45 0 bottom
U$43  [23#MOSI3]  21.34,41.91 0 bottom
U$44  [1#TX1]  21.34,49.53 0 bottom
U$46  [D41]  21.34,52.07 0 bottom
U$47  [24#SCK2]  21.34,39.37 0 bottom
U$48  [0#RX0]  21.34,46.99 0 bottom
U$49  [D518]  5.21,46.99 0 bottom
U$50  [D619]  5.21,44.45 0 bottom
U$51  [D920]  5.21,41.91 0 bottom
U$52  [D1122]  5.46,36.83 0 bottom
U$53  [D1021]  5.84,39.37 0 bottom
U$54  [D1223]  5.84,34.29 0 bottom
U$55  [D1324]  5.84,31.75 0 bottom
U$56  [VUSB1]  7.37,29.21 0 bottom
U$57  [EN25]  5.33,26.67 0 bottom
U$58  [VBAT2]  7.37,24.13 0 bottom
U$59  [D100]  -0.13,38.1 0 top
U$60  [NC0]  17.53,19.05 0 top
U$61  [NC1]  21.34,19.05 0 bottom
U$62  [20#SDA0]  8.64,52.07 0 bottom
U$63  [SAMD510]  8.89,9.53 0 top
U$64  [THING_PLUS1]  8.89,6.99 0 top
U$65  [SAMD510]  23.02,11.94 0 bottom
U$66  [THING_PLUS1]  13.49,11.94 0 bottom
U$67  [I_C0]  6.86,9.91 270 bottom
U$68  [21]  6.1,9.02 270 bottom
U$69  7.11,9.27 90 top
Y1  14.86,50.04 180 top

### Tracks (layer width: path | path; a pad name or v marks a point on that pad's centre or on a via)
3.3V  (via drill 0.25, 0.35)
  Top 0.178: U4.3 12.89,55.75 v12.83,55.75
  Top 0.203: U2.48 16.49,36.16 C3.1 17.04,36.14 17.53,35.65 v17.53,34.86 | U2.34 8.18,34.82 C9.1 v9.14,34.8 | U2.21 4.22,43.66 C8.1 4.01,43.81 v4.01,44.48 | U3.5 9.55,26.61 C10.1 | R1.2 v16.38,12.06 | U4.3 16.47,55.75 R4.2 | C11.1 18.01,41.37 17.71,41.66 U2.56 16.25,41.66 16,41.91 v16,42.35 | L1.1 8.13,52.2 8.51,52.58 9.53,52.58 9.78,52.83 9.78,53.21 | U4.7 9.53,54.48 9.78,54.23 v9.78,53.85 9.78,53.21 | U4.8 9.78,53.21 | v7.11,12.19 7.11,10.79 6.21,9.9 J3.2
  Top 0.406: U3.5 11.02,26.99 v11.02,27.46
  Bottom 0.178: JP1.2 8.13,8.26 v7.62,7.75
  pour Route15: 0,58.42 22.86,58.42 22.86,0 0,0
!RESET  (via drill 0.25)
  Top 0.203: S1.4 13.37,31.46 | U2.52 16.64,39.66 16.19,39.21 16.19,38.1 16.19,38.04 18.77,35.46 v18.77,33.02 18.77,15 19.77,14 19.77,13.97 | 19.77,13.97 R1.1 | J2.1 19.77,13.97
  Top 0.254: 13.37,31.46 v13.34,31.5
  Bottom 0.203: v13.34,31.5 17.25,31.5 v18.77,33.02
A0  (via drill 0.25)
  Top 0.203: v20.32,35.56 20.32,25.4 J2.5 | U2.3 14.18,45.22 v14.2,45.2
  Bottom 0.203: 13.01,44.01 13.01,39.99 14.01,38.99 16.51,38.99 19.94,35.56 v20.32,35.56 | 13.01,44.01 | 13.01,44.01 v14.2,45.2
A1  (via drill 0.25)
  Top 0.203: U2.11 10.18,46.72 11.18,45.72 v13.59,45.72
  Bottom 0.203: v13.59,45.72 13.59,45.21 12.62,44.25 12.62,39.83 13.85,38.61 16.32,38.61 20.45,34.48 20.45,27.81 J2.6
A2  (via drill 0.25)
  Top 0.203: U2.12 9.68,46.58 11.12,45.14 v12.57,45.14
  Route15 0.203: v19.74,29.21 J2.7
  Bottom 0.203: v12.57,45.14 12.57,44.74 12.24,44.41 12.24,39.68 13.69,38.23 16.16,38.23 20.07,34.32 20.07,29.97 19.74,29.64 v19.74,29.21
A3  (via drill 0.25)
  Top 0.203: U2.13 9.18,46.26 v10.69,44.74
  Route15 0.203: v19.43,31.75 J2.8
  Bottom 0.203: v10.69,44.74 10.76,44.74 11.86,43.64 11.86,39.52 13.53,37.85 16,37.85 19.68,34.16 19.68,32 v19.43,31.75
A4  (via drill 0.25)
  Top 0.203: U2.14 8.68,46.18 9.86,45 v9.86,44.74
  Route15 0.203: v18.16,34.16 21.46,34.16 J2.9
  Bottom 0.203: v9.86,44.74 11.48,43.13 11.48,39.36 13.38,37.47 15.85,37.47 18.16,35.15 v18.16,34.16
A5  (via drill 0.25)
  Top 0.203: U2.63 16.59,45.16 14.86,43.43 14.86,41.15 v16,40.01
  Bottom 0.203: v16,40.01 16.64,39.37 19.24,39.37 20.07,38.54 20.07,38.35 J2.10
D0  (via drill 0.25)
  Top 0.203: J2.14 17.5,46.99 13.44,42.93 9.06,42.93 v8.88,42.74 | v8.95,39.05 8.84,39.16 U2.30
  Bottom 0.203: v8.88,42.74 8.88,39.12 v8.95,39.05
D1  (via drill 0.25)
  Top 0.203: v8.09,42.74 8.09,42.78 8.64,43.33 13.19,43.33 19.39,49.53 J2.15 | v7.62,39.75 7.53,39.66 U2.29
  Bottom 0.203: v8.09,42.74 8.09,40.01 7.84,39.75 v7.62,39.75
D4  (via drill 0.25)
  Top 0.203: U2.15 8.18,48.46 v7.95,48.69
  Route2 0.178: v7.95,48.69 8.05,48.69 8.61,49.24 17.76,49.24 20.59,52.07 J2.16
D5  (via drill 0.25)
  Top 0.203: U2.32 4,38.16 3.43,38.73 3.43,44.45 3.43,46.1 v3.38,46.15
  Bottom 0.203: v3.38,46.15 2.54,46.99 J1.10
D6  (via drill 0.25)
  Top 0.203: v10.13,39.08 11.03,38.19 11.03,37.45 11.68,36.8 U2.41
  Bottom 0.203: v10.13,39.08 10.13,42.44 9.12,43.45 2.27,43.45 J1.9
D9
  Top 0.203: U2.16 7.68,47.05 7.37,46.74 3.05,46.74 2.79,46.48 2.79,42.16 2.54,41.91 J1.8
D10
  Top 0.203: U2.37 9.68,37.18 9.14,37.72 2.92,37.72 J1.7
D11
  Top 0.203: U2.35 8.68,36.91 8.51,37.08 6.6,37.08 6.35,36.83 J1.6
D12
  Top 0.203: J1.5 2.54,34.29 3.05,33.78 3.05,32.26 4.46,30.84 8.9,30.84 9.43,31.37 9.43,33.72 10.18,34.47 U2.38
D13  (via drill 0.25)
  Top 0.203: U2.36 9.18,35.59 9.73,35.04 9.73,34.56 9.23,34.05 7.8,34.05 7.64,33.89 7.64,33.68 7.62,33.66 7.62,32 7.37,31.75 D4.A 5.46,31.75 v5.08,31.75
  Bottom 0.203: v5.08,31.75 J1.4
D+
  Top 0.203: J6.D+ 11.46,4.66 11.46,15.01 11.94,15.49 15.65,15.49 16.89,16.73 16.89,32.77 14.18,35.48 U2.46
D-
  Top 0.203: U2.45 13.68,35.34 14.61,34.42 16.48,32.55 16.48,16.86 15.49,15.88 11.43,15.88 10.81,15.25 10.81,4.66 J6.D-
EN
  Top 0.203: J1.2 5.33,26.67 7.86,29.19 9.4,29.19 | U3.3 12.51,28.51 11.83,29.19 9.4,29.19 | R2.1 9.44,29.23 9.4,29.19
FLASH_CS  (via drill 0.25)
  Top 0.178: v15.62,52.2 15.62,53.15 15.56,53.21
  Top 0.203: 15.56,53.21 15.24,53.21 | 15.24,53.21 U4.1 | v10.36,48.64 v8.81,48.64 | U2.19 8.3,44.66 v8.31,44.64 | 15.24,53.21 16.38,53.21 16.51,53.34 R4.1
  Bottom 0.203: v15.62,52.2 12.68,49.26 11.98,49.26 11.37,48.64 v10.36,48.64 | v8.81,48.64 8.31,48.15 v8.31,44.64
FLASH_MISO  (via drill 0.25)
  Top 0.203: 7.54,44.16 v7.62,44.08 7.54,44.16 | U4.2 15.11,54.48 v15.37,54.74 | 7.54,44.16 U2.20
  Route15 0.203: v7.62,45.72 8.38,46.48 13.97,46.48 14.35,46.86 14.35,53.72 v15.37,54.74
  Bottom 0.203: v7.62,44.08 v7.62,45.72
FLASH_MOSI  (via drill 0.25)
  Top 0.178: U4.5 7.49,57.02 6.86,56.39 v6.86,53.29
  Top 0.203: v4.68,45.89 4.91,45.66 U2.17
  Route15 0.203: v6.86,53.29 4.7,51.13 4.7,45.91 v4.68,45.89
FLASH_SCK  (via drill 0.25)
  Top 0.178: v7.47,52.7 7.47,55.41 7.81,55.75 U4.6
  Top 0.203: U2.18 4.19,45.16 v4.09,45.26
  Route2 0.203: v7.47,52.7 5.97,52.7 4.12,50.85 4.12,45.24 v4.09,45.26
GND  (via drill 0.25)
  Top 0.178: C13.2 19.21,37.66 v18.85,38.02
  Top 0.203: C6.2 9.53,23.11 9.65,22.99 U1.2 12.06,22.99 v12.19,23.11 | C19.2 v15.11,24.64 | v12.45,27.56 U3.2 15.11,27.56 C7.2 | C10.2 8.55,28.28 v8.51,28.32 | R8.1 6.77,33.82 7.04,34.09 C9.2 7.04,36.14 v6.99,36.2 7.02,36.16 U2.33 | R7.1 14.97,18.97 v14.1,18.97 | v6.73,42.8 6.37,43.16 U2.22 4.99,43.16 4.83,43 4.83,42.55 4.75,42.47 C8.2 | U2.7 12.18,48.63 v12.22,48.67 | U2.54 17.2,40.64 17.78,40.64 18.21,40.21 C11.2 | U2.47 14.68,35.52 15.22,34.98 C3.2
  Top 0.406: R6.1 v10.41,25.27
  other vias: 20.07,43.78 15.49,35.18 13.34,33.02 12.7,13.59 12.7,14.35 13.46,14.35 13.46,13.59 5.84,16.13 6.6,16.13 7.37,16.13 8.76,14.61 16.35,48.58 13.75,40.26 20.1,45.72 15.02,46.1 15.91,43.31
  pour Top: 0,58.42 22.86,58.42 22.86,0 0,0
  pour Route2: 0,58.42 22.86,58.42 22.86,0 0,0
  pour Bottom: 0,58.42 22.86,58.42 22.86,0 0,0
MISO  (via drill 0.25)
  Top 0.203: U2.24 13.59,42.16 v13.8,42.37
  Bottom 0.203: v13.8,42.37 14,42.57 14,43.57 14.88,44.45 J2.13
MOSI  (via drill 0.25)
  Top 0.203: U2.25 v14.17,41.66
  Bottom 0.203: J2.12 16.76,41.91 16.51,41.66 v14.17,41.66
N$1
  Top 0.203: R8.2 8.5,33.25 D4.C
N$2  (via drill 0.35)
  Top 0.178: R5.2 8.04,6.77 v7.62,6.35
  Bottom 0.178: v7.62,6.35 8.51,6.35 8.89,6.73 JP1.3
N$3  (via drill 0.35)
  Top 0.178: R9.2 v8.89,13.46
  Bottom 0.178: v8.89,13.46 JP1.1
N$9
  Top 0.203: D1.C 8.5,24.13 8.91,24.54 10.77,24.54 11.02,24.29 U1.1
N$14
  Top 0.203: U1.5 13.62,24.35 13.17,24.8 R6.2
N$17
  Top 0.203: R3.2 5.88,24.16 D1.A
SCK  (via drill 0.25)
  Top 0.203: v14.33,40.84 14.01,41.16 U2.26
  Bottom 0.178: 17.78,40.64 14.53,40.64 v14.33,40.84
  Bottom 0.203: J2.11 20.22,39.37 19.84,39.75 18.67,39.75 17.78,40.64
SCL  (via drill 0.25)
  Top 0.178: R5.1 7.33,8.47 6.75,7.9 J3.4
  Top 0.203: U2.44 13.18,37.24 12.01,38.41 v11.61,38.41 | J3.4 3.33,7.9 v3.17,7.75
  Route15 0.203: v11.61,38.41 11.92,38.41 12.29,38.04 12.29,35.15 4.29,27.15 4.29,8.26 3.78,7.75 v3.17,7.75
  Bottom 0.203: v11.61,38.41 11.61,38.69 11.1,39.2 11.1,42.68 9.28,44.5 9.28,44.99 9.78,45.48 9.78,49.28 8.51,50.55 5.71,50.55 4.7,49.53 J1.11
SDA  (via drill 0.25)
  Top 0.152: 8.04,10.58 6.36,8.9 6.34,8.9
  Top 0.178: 6.34,8.9 J3.3 | R9.1 8.04,10.58
  Top 0.203: U2.43 12.68,37.2 12.37,37.51 11.79,37.51 v11.68,37.62 | J3.3 v3.12,8.89 | v6.48,49.91 6.48,50.67 5.08,52.07 J1.12
  Route15 0.203: v11.68,37.62 11.68,35.81 3.12,27.25 v3.12,8.89
  Bottom 0.203: v11.68,37.62 11.48,37.82 11.37,37.82 10.72,38.47 10.72,42.52 8.9,44.34 8.9,45.14 9.4,45.64 9.4,49.02 8.51,49.91 v6.48,49.91
SWDCLK
  Top 0.203: U2.57 18.54,42.16 18.91,42.53 18.91,42.54 19.05,42.68 TP2.P$1
SWDIO
  Top 0.203: U2.58 18.15,42.66 18.4,42.91 18.4,43.45 19.05,44.1 TP1.P$1
V_BATT
  Top 0.406: J1.1 3.56,24.13 4.32,23.37 4.32,19.81 4.59,19.54 J4.2 10.02,19.54 10.88,20.4 Q1.3 11.94,21.84 11.74,22.04 U1.3 9.55,22.04 C6.1
V_USB  (via drill 0.25)
  Top 0.203: R3.1 7.58,26.38 v7.62,26.42 | 13.65,22.01 14.31,22.01 14.44,21.88 C19.1
  Top 0.305: Q1.1 10.99,17.72 10.66,17.39 D2.A 10.67,16 10.16,15.49 10.16,4.66 J6.VBUS
  Top 0.406: Q1.1 10.99,19.12 11.18,19.3 13.34,19.3 13.62,19.59 U1.4 | U1.4 13.65,22.01 | v13.97,22.86 13.62,22.51 U1.4 | R7.2 C19.1
  Bottom 0.406: v13.97,22.86 13.51,22.4 8.33,22.4 7.62,23.11 v7.62,26.42 7.62,28.7 7.11,29.21 J1.3
VCC
  Top 0.203: U2.53 17.68,40.16 17.96,39.89 17.96,39.67 18.26,39.36 C13.1 19.84,40.79 19.94,40.79 C14.1
VDDA
  Top 0.203: L1.2 9.51,49.95 C12.1 10.11,49.97 10.16,49.91 10.8,49.91 10.86,49.97 C15.1 10.92,49.15 11.68,48.39 U2.8 11.68,46.87 11.94,46.61 13.46,46.61 13.68,46.83 U2.4
VIN
  Top 0.203: C7.1 15.66,26.58 15.88,26.8 15.88,27.6 15.89,27.62 15.89,28.95 14.87,29.97 R2.2
  Top 0.305: D2.C 12.96,17.52 12.89,17.59 12.89,18.29 Q1.2
  Top 0.406: 12.89,18.29 14.07,18.29 14.46,17.9 15.77,17.9 15.99,18.13 15.99,24.73 15.4,25.32 15.32,25.32 15.11,25.53 C7.1 15.09,26.61 U3.1
XIN32
  Top 0.203: U2.1 15.18,49.72 15.49,50.04 Y1.P$1 16.76,50.04 16.82,50.09 C1.1
XOUT32
  Top 0.203: U2.2 14.68,49.71 14.35,50.04 Y1.P$2 12.95,50.04 12.9,50.09 C2.1

### Text on the board
Top: 1
Route2: 2
Route15: 3
Bottom: 4 | v10
tPlace: + | -
Measures: Units in inches
tDocu: Mike Hord, Mary West & Andy England